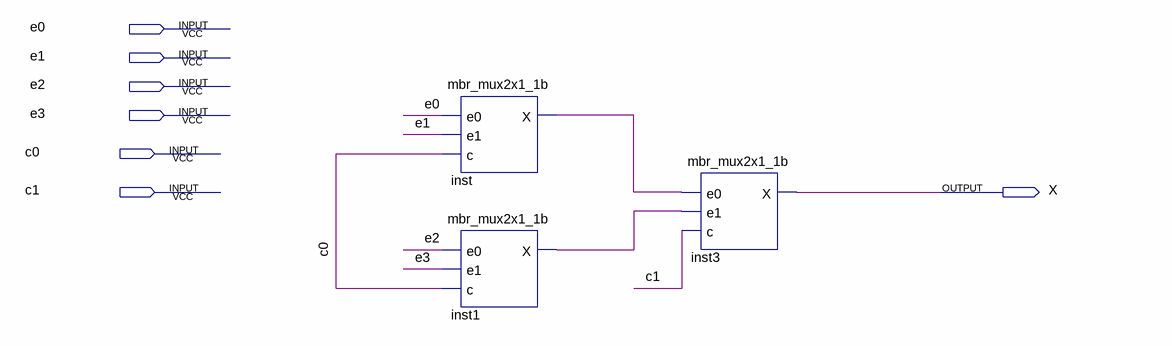
[diagram p0: schematic sheet]
// Quartus schematic mbr_mux4x1_1b.bdf as structural Verilog: 3 symbols, 7 pins
module mbr_mux4x1_1b (
  input  e0,
  input  e1,
  input  e2,
  input  e3,
  input  c0,
  input  c1,
  output X
);

  wire inst1_x, inst_x;

  mbr_mux2x1_1b inst (.e0(e0), .e1(e1), .c(c0), .X(inst_x));
  mbr_mux2x1_1b inst1 (.e0(e2), .e1(e3), .c(c0), .X(inst1_x));
  mbr_mux2x1_1b inst3 (.e0(inst_x), .e1(inst1_x), .c(c1), .X(X));
endmodule
